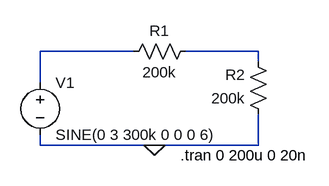
[diagram p0: schematic Exp2part6.asc]
Exp2part6.asc, the LTspice schematic file:
Version 4
SHEET 1 880 680
WIRE 128 112 -16 112
WIRE 320 112 208 112
WIRE 320 128 320 112
WIRE -16 160 -16 112
WIRE -16 256 -16 240
WIRE 160 256 -16 256
WIRE 320 256 320 208
WIRE 320 256 160 256
FLAG 160 256 0
SYMBOL voltage -16 144 R0
WINDOW 123 0 0 Left 0
WINDOW 39 0 0 Left 0
SYMATTR InstName V1
SYMATTR Value SINE(0 3 300k 0 0 0 6)
SYMBOL res 224 96 R90
WINDOW 0 0 56 VBottom 2
WINDOW 3 32 56 VTop 2
SYMATTR InstName R1
SYMATTR Value 200k
SYMBOL res 336 224 R180
WINDOW 0 36 76 Left 2
WINDOW 3 36 40 Left 2
SYMATTR InstName R2
SYMATTR Value 200k
TEXT 200 272 Left 2 !.tran 0 200u 0 20n

The netlist it stands for:
* Exp2part6.asc
V1 N001 0 SINE(0 3 300k 0 0 0 6)
R1 N002 N001 200k
R2 0 N002 200k
.tran 0 200u 0 20n
.backanno
.end